# Altium project VOLTAGE_PEAK.PrjPCB
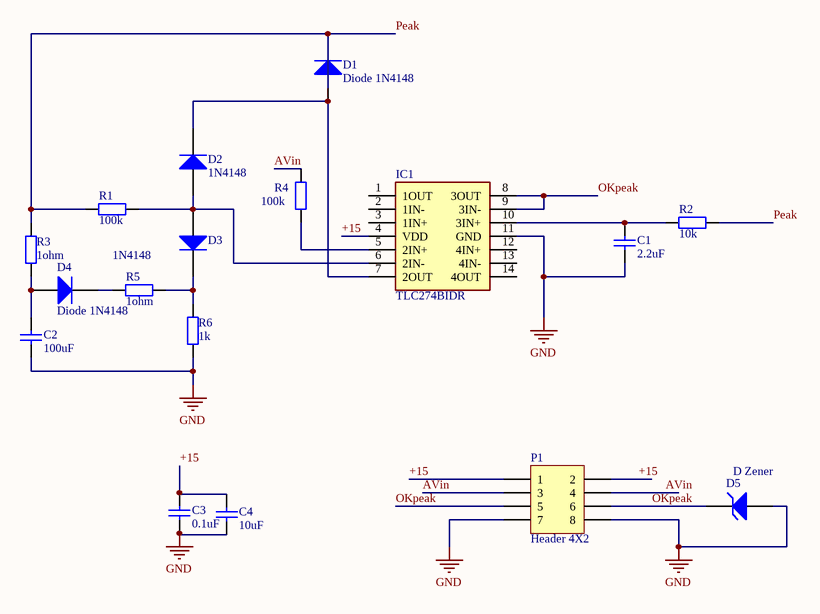
[diagram p0: VOLTAGE_PEAK.SchDoc]
1 sheet, 17 parts. Net scope: global (net labels, ports and power ports of the same name join across sheets).
Board file: VOLTAGE_PEAK.PcbDoc

## Sheet VOLTAGE_PEAK.SchDoc
size A4

### Parts
C1  value 2.2uF  [C1210]  (hidden comment: Cap)
C2  value 100uF  [C1210]  (hidden comment: Cap)
C3  value 0.1uF  [1608[0603]]  (hidden comment: Cap)
C4  value 10uF  [C1210]  (hidden comment: Cap)
D1  Diode 1N4148  [DO-35]
D2  1N4148  [DO-35]
D3  1N4148  [DO-35]
D4  Diode 1N4148  [DO-35]
D5  D Zener  [C1206]
IC1  TLC274BIDR  [SOIC127P600X175-14N]
P1  Header 4X2  [HDR2X4]
R1  value 100k  [C1206]  (hidden comment: Res2)
R2  value 10k  [C1206]  (hidden comment: Res2)
R3  value 1ohm  [0402]  (hidden comment: Res2)
R4  value 100k  [C1206]  (hidden comment: Res2)
R5  value 1ohm  [0402]  (hidden comment: Res2)
R6  value 1k  [C1206]  (hidden comment: Res2)

### Nets
GND: C1.2 C2.2 C3.1 C4.2 D5.1(A) IC1.11(GND) P1.7 P1.8 R6.1
+15: C3.2 C4.1 IC1.4(VDD) P1.1 P1.2
AVin: P1.3 P1.4 R4.1
OKpeak: D5.2(K) IC1.8(3OUT) IC1.9(3IN-) P1.5 P1.6
Peak: D1.2(K) R1.1 R2.2 R3.2
NetC1_1: C1.1 IC1.10(3IN+) R2.1
NetC2_1: C2.1 D4.1(A) R3.1
NetD1_1: D1.1(A) D2.2(K) IC1.7(2OUT)
NetD2_1: D2.1(A) D3.1(A) IC1.6(2IN-) R1.2
NetD3_2: D3.2(K) R5.2 R6.2
NetD4_2: D4.2(K) R5.1
NetIC1_5: IC1.5(2IN+) R4.2

Not connected (* = marked no-connect by the designer): IC1 1(1OUT) 2(1IN-) 3(1IN+) 12(4IN+) 13(4IN-) 14(4OUT)

### Library data of the parts
C1-C4 = Cap: Capacitor; Published: 8-Jun-2000; LatestRevisionDate: 17-Jul-2002; LatestRevisionNote: Re-released for DXP Platform.; PackageReference: RAD-0.3; Publisher: Altium Limited; PackageDescription: Radial Cap, Thru-Hole; 2 Leads; 0.3 in Pin Spacing
D1-D4 = Diode 1N4148: High Conductance Fast Diode; Published: 8-Jun-2000; LatestRevisionDate: 17-Jul-2002; LatestRevisionNote: Re-released for DXP Platform.; DatasheetVersion: 1997; PackageReference: DO-35; Publisher: Altium Limited; PackageDescription: Diode, Axial; Body 3.8 x 1.9 mm (LxDia. max), Lead Dia. 0.53 mm (max); Code_JEDEC: DO-204-AH; ComponentLink1Description: Manufacturer Link; ComponentLink1URL: http://www.fairchildsemi.com/; ComponentLink2Description: Datasheet; ComponentLink2URL: http://www.fairchildsemi.com/ds/1N%2F1N4148.pdf
D5 = D Zener: Zener Diode; Published: 8-Jun-2000; LatestRevisionDate: 17-Jul-2002; LatestRevisionNote: Re-released for DXP Platform.; PackageReference: DIODE-0.7; Publisher: Altium Limited; PackageDescription: Diode, Thru-Hole; 2 Leads; 0.7 in Pin Spacing
IC1 = TLC274BIDR: Integrated Circuit; Manufacturer_Name: Texas Instruments; Datasheet Link: http://www.ti.com/lit/gpn/TLC274B; Manufacturer_Part_Number: TLC274BIDR; Mouser Part Number: 595-TLC274BIDR; Mouser Price/Stock: https://www.mouser.com/Search/Refine.aspx?Keyword=595-TLC274BIDR; RS Part Number: 6610212; RS Price/Stock: https://uk.rs-online.com/web/p/products/6610212
P1 = Header 4X2: Header, 4-Pin, Dual row; LatestRevisionDate: 17-Jul-2002; LatestRevisionNote: Re-released for DXP Platform.; Publisher: Altium Limited
R1-R6 = Res2: Resistor; Published: 8-Jun-2000; LatestRevisionDate: 17-Jul-2002; LatestRevisionNote: Re-released for DXP Platform.; PackageReference: AXIAL-0.4; Publisher: Altium Limited; PackageDescription: Axial Device, Thru-Hole; 2 Leads; 0.4 in Pin Spacing